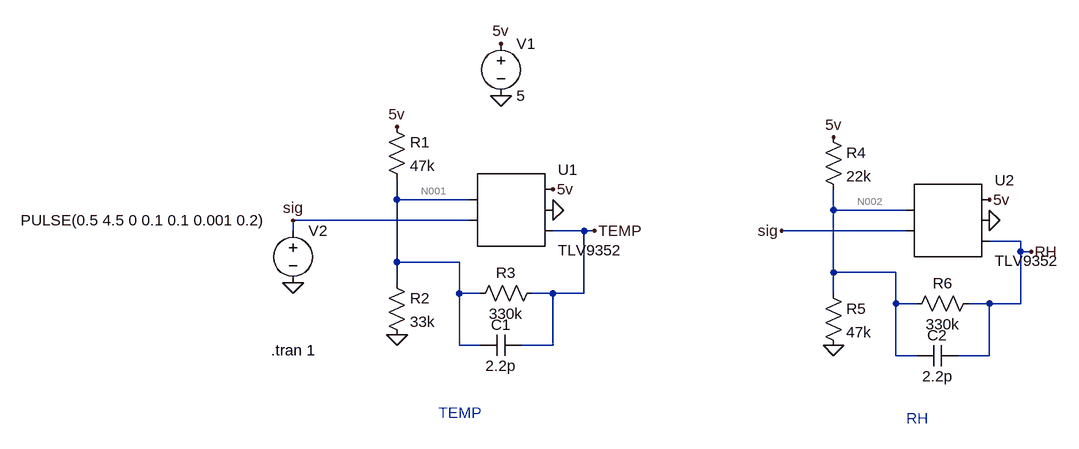
[diagram p0: schematic Trigger.asc]
Trigger.asc, the LTspice schematic file:
Version 4
SHEET 1 1364 680
WIRE 176 128 176 96
WIRE 288 128 176 128
WIRE 848 144 848 112
WIRE 960 144 848 144
WIRE 288 160 16 160
WIRE 16 176 16 160
WIRE 464 176 416 176
WIRE 480 176 464 176
WIRE 960 176 768 176
WIRE 1136 192 1088 192
WIRE 1136 208 1136 192
WIRE 1152 208 1136 208
WIRE 176 224 176 128
WIRE 272 224 176 224
WIRE 848 240 848 144
WIRE 944 240 848 240
WIRE 176 256 176 224
WIRE 272 272 272 224
WIRE 304 272 272 272
WIRE 416 272 384 272
WIRE 464 272 464 176
WIRE 464 272 416 272
WIRE 848 272 848 240
WIRE 944 288 944 240
WIRE 976 288 944 288
WIRE 1088 288 1056 288
WIRE 1136 288 1136 208
WIRE 1136 288 1088 288
WIRE 272 352 272 272
WIRE 304 352 272 352
WIRE 416 352 416 272
WIRE 416 352 368 352
WIRE 944 368 944 288
WIRE 976 368 944 368
WIRE 1088 368 1088 288
WIRE 1088 368 1040 368
FLAG 336 -32 0
FLAG 416 144 0
FLAG 416 112 5v
FLAG 336 -112 5v
FLAG 16 256 0
FLAG 176 336 0
FLAG 176 16 5v
FLAG 16 160 sig
FLAG 1088 160 0
FLAG 1088 128 5v
FLAG 848 352 0
FLAG 848 32 5v
FLAG 768 176 sig
FLAG 1152 208 RH
FLAG 480 176 TEMP
SYMBOL voltage 336 -128 R0
WINDOW 123 0 0 Left 0
WINDOW 39 0 0 Left 0
SYMATTR InstName V1
SYMATTR Value 5
SYMBOL AutoGenerated\\TLV9352 352 144 R0
SYMATTR InstName U1
SYMBOL voltage 16 160 R0
WINDOW 3 -419 0 Left 2
WINDOW 123 0 0 Left 0
WINDOW 39 0 0 Left 0
SYMATTR InstName V2
SYMATTR Value PULSE(0.5 4.5 0 0.1 0.1 0.001 0.2)
SYMBOL res 160 0 R0
SYMATTR InstName R1
SYMATTR Value 47k
SYMBOL res 160 240 R0
SYMATTR InstName R2
SYMATTR Value 33k
SYMBOL res 400 256 R90
WINDOW 0 0 56 VBottom 2
WINDOW 3 32 56 VTop 2
SYMATTR InstName R3
SYMATTR Value 330k
SYMBOL cap 368 336 R90
WINDOW 0 0 32 VBottom 2
WINDOW 3 32 32 VTop 2
SYMATTR InstName C1
SYMATTR Value 2.2p
SYMBOL AutoGenerated\\TLV9352 1024 160 R0
SYMATTR InstName U2
SYMBOL res 832 16 R0
SYMATTR InstName R4
SYMATTR Value 22k
SYMBOL res 832 256 R0
SYMATTR InstName R5
SYMATTR Value 47k
SYMBOL res 1072 272 R90
WINDOW 0 0 56 VBottom 2
WINDOW 3 32 56 VTop 2
SYMATTR InstName R6
SYMATTR Value 330k
SYMBOL cap 1040 352 R90
WINDOW 0 0 32 VBottom 2
WINDOW 3 32 32 VTop 2
SYMATTR InstName C2
SYMATTR Value 2.2p
TEXT -18 360 Left 2 !.tran 1
TEXT 960 464 Left 2 ;RH
TEXT 240 456 Left 2 ;TEMP

The netlist it stands for:
* Trigger.asc
V1 5v 0 5
* U1: TLV9352 (symbol AutoGenerated\TLV9352 not available, pins judged from their places): pin1=N001 pin2=sig pin3=5v pin4=0 pin5=TEMP
V2 sig 0 PULSE(0.5 4.5 0 0.1 0.1 0.001 0.2)
R1 5v N001 47k
R2 N001 0 33k
R3 TEMP N001 330k
C1 TEMP N001 2.2p
* U2: TLV9352 (symbol AutoGenerated\TLV9352 not available, pins judged from their places): pin1=N002 pin2=sig pin3=5v pin4=0 pin5=RH
R4 5v N002 22k
R5 N002 0 47k
R6 RH N002 330k
C2 RH N002 2.2p
.tran 1
* RH
* TEMP
.backanno
.end

* Results of the author's LTspice run, read from the files saved beside the schematic
* Operating Point, zero values left out:
*   V(5v) = 5 V
*   V(temp) = 5.008 V
*   V(sig) = 500 mV
*   V(n001) = 2.226 V
*   V(rh) = 5.008 V
*   V(n002) = 3.475 V
*   I(R6) = 4.644 µA
*   I(R5) = 73.94 µA
*   I(R4) = 69.3 µA
*   I(R3) = 8.43 µA
*   I(R2) = 67.45 µA
*   I(R1) = 59.02 µA
*   I(V2) = 20.01 pA
*   I(V1) = -1.261 mA
*   Ix(u1:IN+) = 8.793 pA
*   Ix(u1:IN-) = -10 pA
*   Ix(u1:VCC) = 568.4 µA
*   Ix(u1:VEE) = -560 µA
*   Ix(u1:OUT) = -8.43 µA
*   Ix(u2:IN+) = 15.19 pA
*   Ix(u2:IN-) = -10 pA
*   Ix(u2:VCC) = 564.6 µA
*   Ix(u2:VEE) = -560 µA
*   Ix(u2:OUT) = -4.644 µA